# EAGLE schematic node (EAGLE 7.5.0)
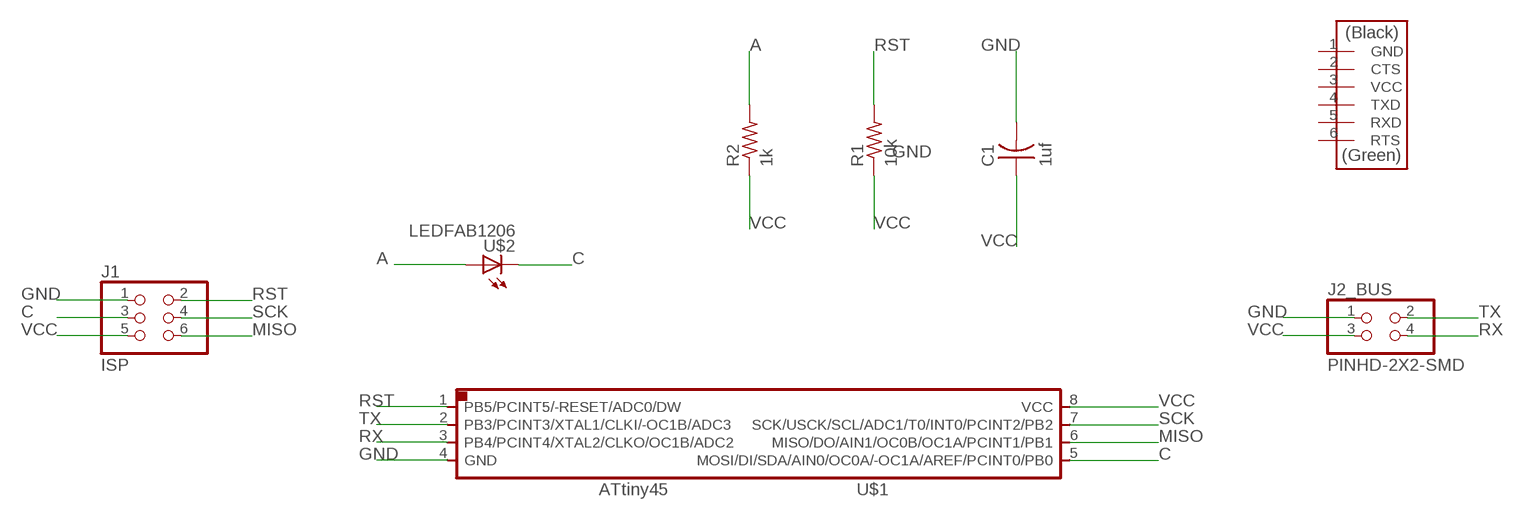
[diagram p0: schematic, sheet 1]

## Parts
C1  1uf  CAP-US1206FAB  [C1206FAB]
J1  ISP  PINHD-2X3-SMD  [2X03SMD]
J2_BUS  PINHD-2X2-SMD  [2X02SMD]
R1  10k  RES-US1206FAB  [R1206FAB]
R2  1k  RES-US1206FAB  [R1206FAB]
U$1  ATTINY45SI  [SOIC8]
U$2  LEDFAB1206  [LED1206FAB]
U$3  FTDI-SMD-HEADER  [1X06SMD]

## Nets
A: R2.2 U$2.1(A)
C: J1.3 U$1.5(MOSI/DI/SDA/AIN0/OC0A/-OC1A/AREF/PCINT0/PB0) U$2.2(C)
GND: C1.2 J1.1 J2_BUS.1 U$1.4(GND)
MISO: J1.6 U$1.6(MISO/DO/AIN1/OC0B/OC1A/PCINT1/PB1)
RST: J1.2 R1.2 U$1.1(PB5/PCINT5/-RESET/ADC0/DW)
RX: J2_BUS.4 U$1.3(PB4/PCINT4/XTAL2/CLKO/OC1B/ADC2)
SCK: J1.4 U$1.7(SCK/USCK/SCL/ADC1/T0/INT0/PCINT2/PB2)
TX: J2_BUS.2 U$1.2(PB3/PCINT3/XTAL1/CLKI/-OC1B/ADC3)
VCC: C1.1 J1.5 J2_BUS.3 R1.1 R2.1 U$1.8(VCC)
Unconnected: U$3.1(GND) U$3.2(CTS) U$3.3(VCC) U$3.4(TXD) U$3.5(RXD) U$3.6(RTS)

## Library data of the parts
C1 = fab:CAP-US
J1 = fab:PINHD-2X3-SMD: PIN HEADER
J2_BUS = fab:PINHD-2X2-SMD
R1 R2 = fab:RES-US: Resistor (US Symbol) Variants with postfix FAB are widened to allow the routing of internal traces
U$1 = fab:ATTINY45
U$2 = fab:LED: LED
U$3 = fab:FTDI-SMD-HEADER